# EAGLE design PAD03 (EAGLE 8.3.2)
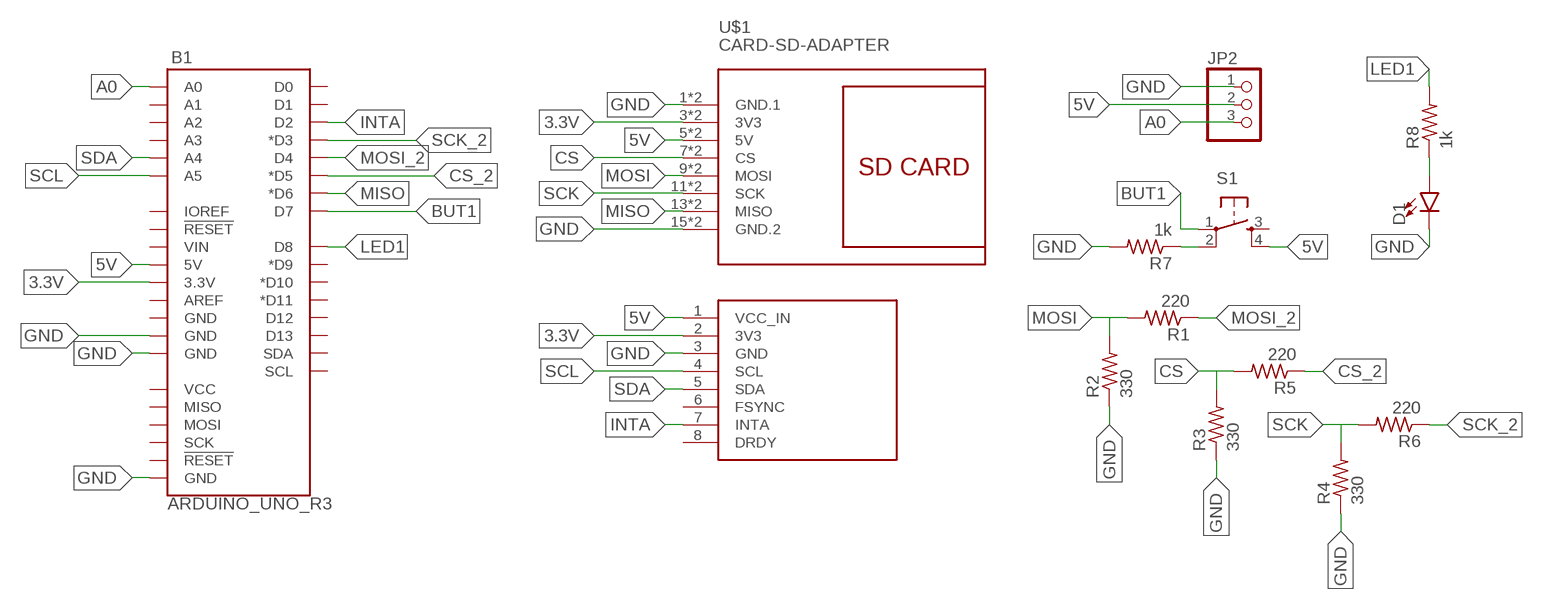
[diagram p0: schematic, sheet 1]

## Parts
B1  ARDUINO_UNO_R3  [ARDUINO_R3]
D1  LED5MM  [LED_5MM]
JP2  PINHD-1X3  [1X03]
R1  220  R-US_0204/7  [0204/7]
R2  330  R-US_0204/7  [0204/7]
R3  330  R-US_0204/7  [0204/7]
R4  330  R-US_0204/7  [0204/7]
R5  220  R-US_0204/7  [0204/7]
R6  220  R-US_0204/7  [0204/7]
R7  1k  R-US_0204/7  [0204/7]
R8  1k  R-US_0204/7  [0204/7]
S1  TAC_SWITCHPTH  [TACTILE-PTH]
U$1  CARD-SD-ADAPTER  [CARD-SD-ADAPTER]
U$2  GY-86  [GY-86]

## Nets
3.3V: B1.3.3V U$1.3(3V3) U$1.4(3V3) U$2.2(3V3)
5V: B1.5V JP2.2 S1.4 U$1.5(5V) U$1.6(5V) U$2.1(VCC_IN)
A0: B1.A0 JP2.3
BUT1: B1.D7 S1.1
CS: R3.2 R5.2 U$1.7(CS) U$1.8(CS)
CS_2: B1.D5(*D5) R5.1
GND: B1.GND@1(GND) B1.GND@2(GND) B1.GND@3(GND) D1.K(C) JP2.1 R2.1 R3.1 R4.1 R7.2 U$1.1(GND.1) U$1.2(GND.1) U$1.15(GND.2) U$1.16(GND.2) U$2.3(GND)
INTA: B1.D2 U$2.7(INTA)
LED1: B1.D8 R8.2
MISO: B1.D6(*D6) U$1.13(MISO) U$1.14(MISO)
MOSI: R1.2 R2.2 U$1.9(MOSI) U$1.10(MOSI)
MOSI_2: B1.D4 R1.1
N$1: R7.1 S1.2
N$2: D1.A R8.1
SCK: R4.2 R6.2 U$1.11(SCK) U$1.12(SCK)
SCK_2: B1.D3(*D3) R6.1
SCL: B1.A5 U$2.4(SCL)
SDA: B1.A4 U$2.5(SDA)
Unconnected: B1.A1 B1.A2 B1.A3 B1.AREF B1.D0 B1.D1 B1.D9(*D9) B1.D10(*D10) B1.D11(*D11) B1.D12 B1.D13 B1.GND@4(GND) B1.IOREF B1.MISO B1.MOSI B1.RESET@1(!RESET!) B1.RESET@2(!RESET!) B1.SCK B1.SCL B1.SDA B1.VCC B1.VIN S1.3 U$2.6(FSYNC) U$2.8(DRDY)

## Library data of the parts
B1 = SparkFun-Boards:ARDUINO_UNO_R3: Arduino R3 Footprint with SPI header Arduino Uno R3 Compatible Footprint. Matches PCB size of the original board. SparkFun Products: SAMD21 Dev Breakout <https://www.sparkfun.com/products/13672> RedBoard <https://www.sparkfun.com/products/12757> R3 Stackable Headers <https://www.sparkfun.com/products/11417>
D1 = SparkFun-LED:LED: LED (Generic) Standard schematic elements and footprints for 5mm, 3mm, 1206, and 0603 sized LEDs. Generic LEDs with no color specified.
JP2 = pinhead:PINHD-1X3: PIN HEADER
R1-R8 = resistor:R-US_: RESISTOR, American symbol
S1 = SparkFun-Retired:TAC_SWITCH: Momentary Switch Button commonly used for reset or general input. Spark Fun Electronics SKU : COM-00097 SMT- SWCH-08247
U$1 = diy-modules:CARD-SD-ADAPTER: Full Size SD Card Adapter Module with onboard 3.3V regulator Guide describing how to use SD card with Arduino is available here: https://www.arduino.cc/en/Reference/SDCardNotes Click here to find device on ebay.com <http://www.ebay.com/sch/sd+card+socket+module>
U$2 = GY_Boards:GY-86

## Net classes
0 default: width 1 mm, drill 1 mm, clearance 0.025 mm

## Board
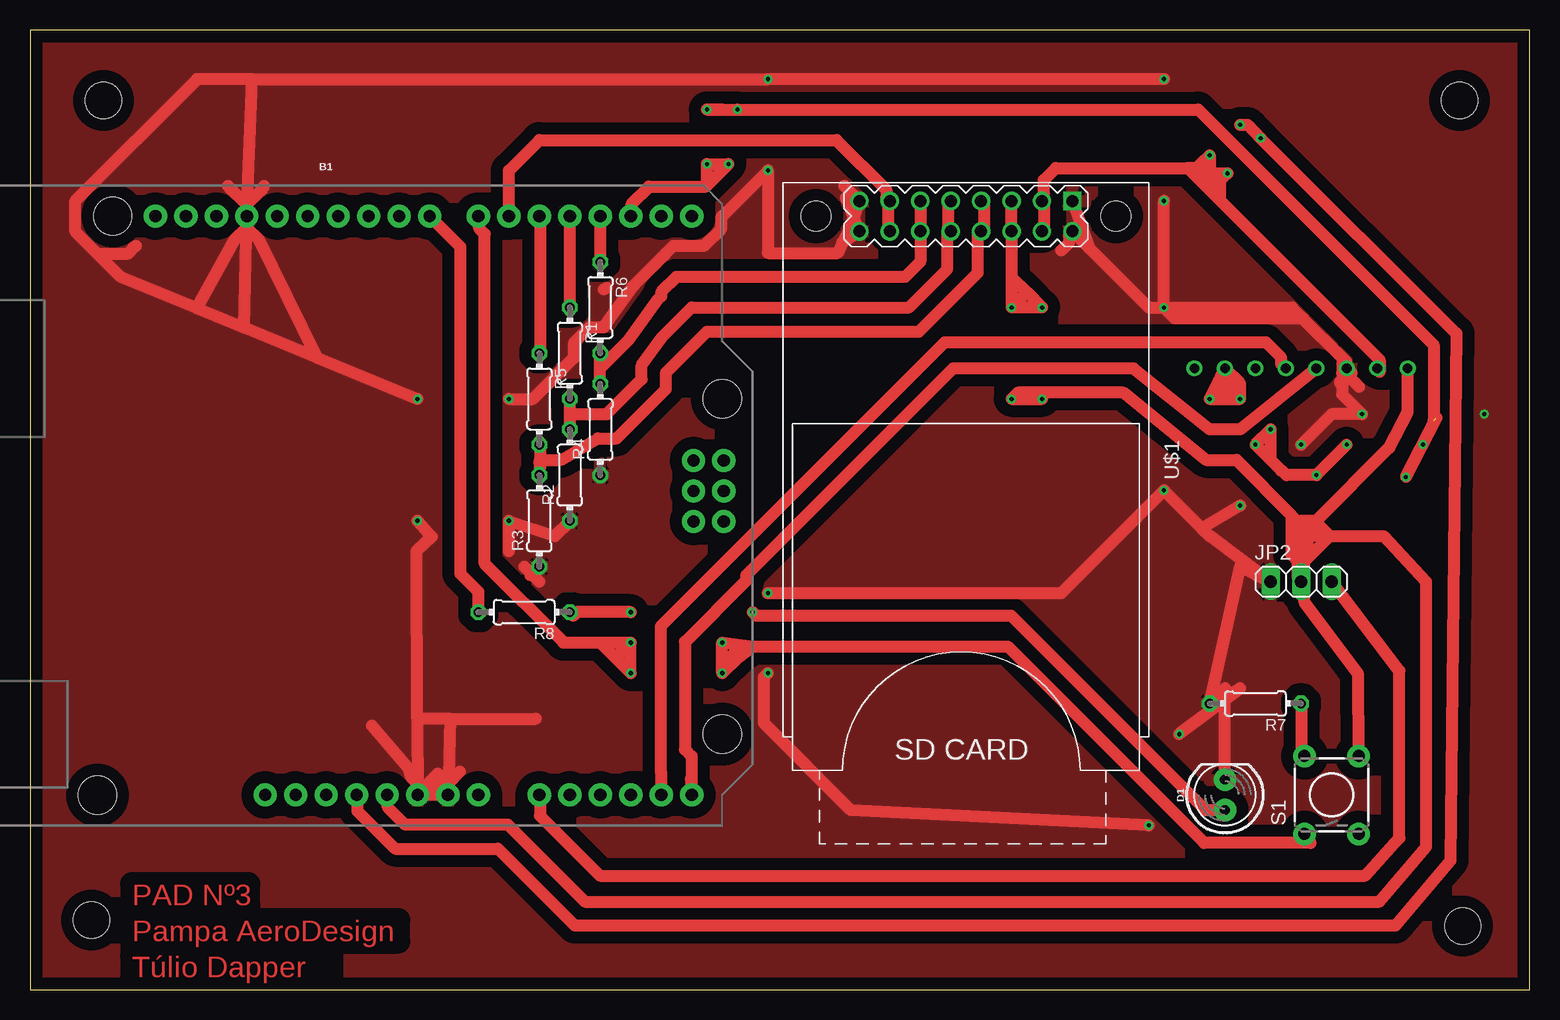
[diagram p1: board, top side]
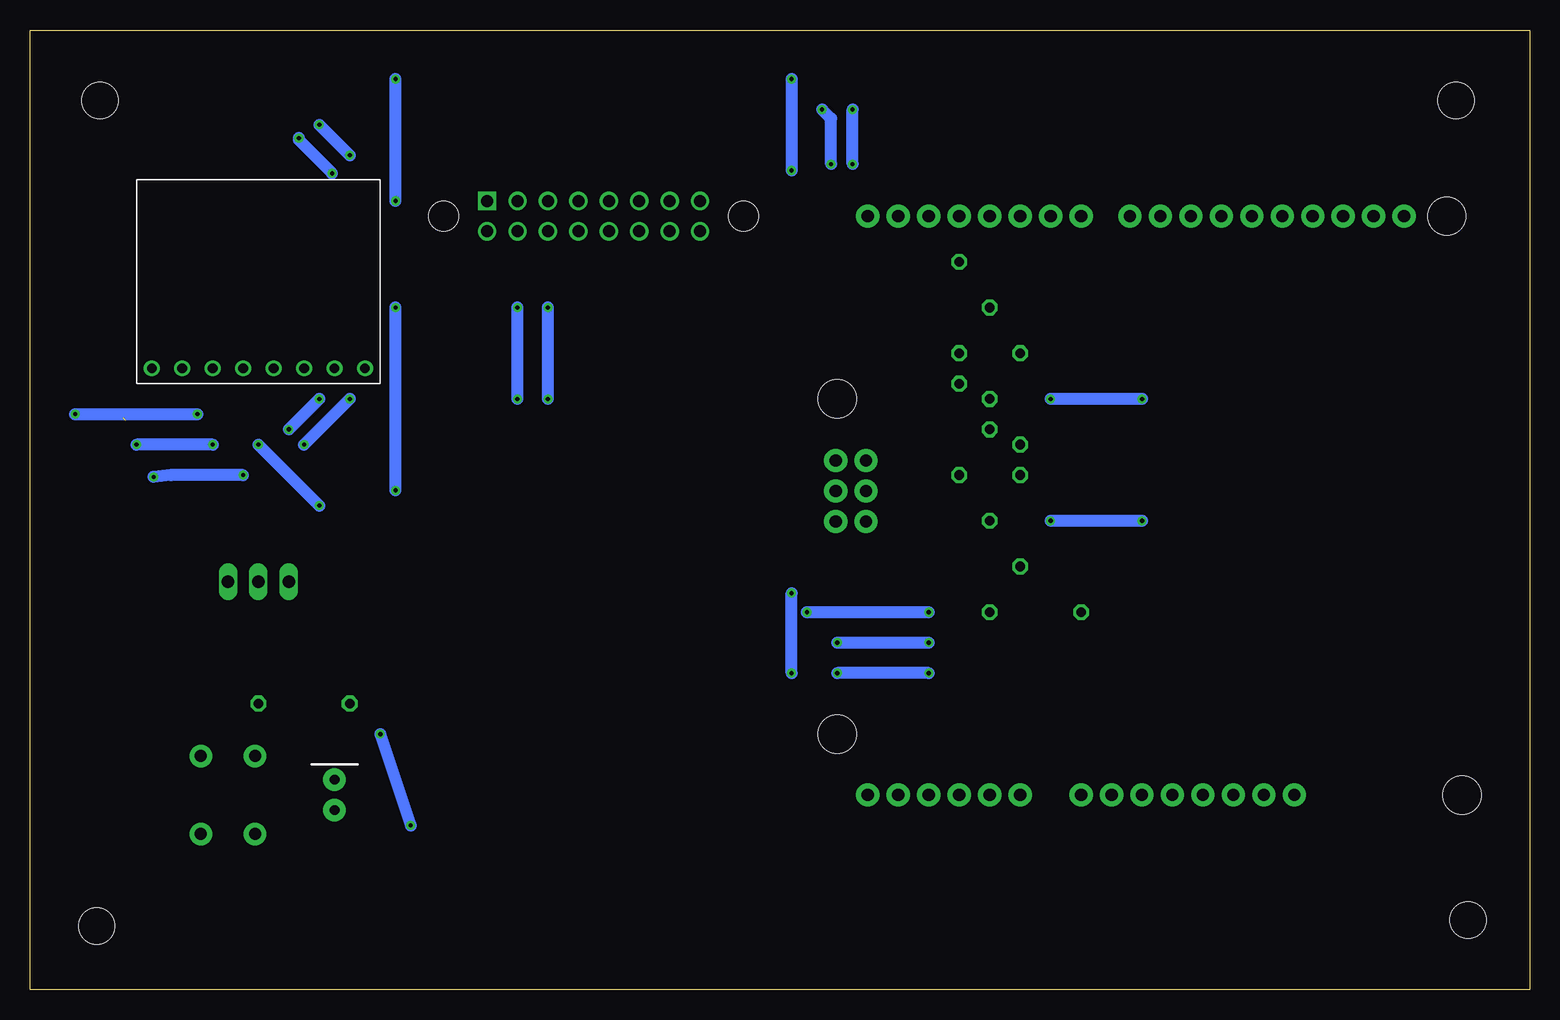
[diagram p2: board, bottom side, seen from below]

Size 125 x 80 mm. Coordinates in mm from the lower left corner, seen from the top.
Outline: 0,0 125,0 125,80 0,80 0,0
Copper layers (1*16): Top 0.035mm / dielectric 1.5mm / Bottom 0.035mm
Design rules "default *": minimum track width 1mm, minimum drill 0.35mm, track to track 1mm, track to pad 1mm, pad to pad 1mm, via to via 1mm, smd to smd 6mil, copper to edge 40mil, drill to drill 1mm, minimum pad ring 10mil, minimum via ring 8mil, stop-mask expansion 4mil, vias tented up to drill 0mil, thermal gap 10mil
Holes 3 mm at 119.43,5.29 5.13,5.79 6.13,74.12 119.16,74.12

### Footprints (pad centres in the part's own frame; a part is rotated, then mirrored left to right if it is on the bottom)
ARDUINO_R3 = drill 1.016 pad 1.93: 3.3V 2.54,-24.13; 5V 5.08,-24.13; A0 17.78,-24.13; A1 20.32,-24.13; A2 22.86,-24.13; A3 25.4,-24.13; A4 27.94,-24.13; A5 30.48,-24.13; AREF -9.144,24.13; D0 30.48,24.13; D1 27.94,24.13; D2 25.4,24.13; D3 22.86,24.13; D4 20.32,24.13; D5 17.78,24.13; D6 15.24,24.13; D7 12.7,24.13; D8 8.636,24.13; D9 6.096,24.13; D10 3.556,24.13; D11 1.016,24.13; D12 -1.524,24.13; D13 -4.064,24.13; GND@1 7.62,-24.13; GND@2 10.16,-24.13; GND@3 -6.604,24.13; GND@4 33.16,-1.32; IOREF -2.54,-24.13; MISO 30.62,3.76; MOSI 33.16,1.22; NC -5.08,-24.13; RESET@1 0,-24.13; RESET@2 30.62,-1.32; SCK 30.62,1.22; SCL -14.224,24.13; SDA -11.684,24.13; VCC 33.16,3.76; VIN 12.7,-24.13 | hole 3.175: -17.78,24.13; 33.02,8.89; 33.02,-19.05; -19.05,-24.13
LED_5MM = drill 0.813 pad 1.88: A -1.27,0; K 1.27,0
1X03 = drill 1.016 long: 1 -2.54,0; 2 0,0; 3 2.54,0
0204/7 = drill 0.813 octagon: 1 -3.81,0; 2 3.81,0
TACTILE-PTH = drill 1.016 pad 1.88: 1 -3.251,2.261; 2 3.251,2.261; 3 -3.251,-2.261; 4 3.251,-2.261
CARD-SD-ADAPTER = drill 1 square: 1 -21.59,8.89 | drill 1: 2 -19.05,8.89; 3 -21.59,6.35; 4 -19.05,6.35; 5 -21.59,3.81; 6 -19.05,3.81; 7 -21.59,1.27; 8 -19.05,1.27; 9 -21.59,-1.27; 10 -19.05,-1.27; 11 -21.59,-3.81; 12 -19.05,-3.81; 13 -21.59,-6.35; 14 -19.05,-6.35; 15 -21.59,-8.89; 16 -19.05,-8.89 | hole 2.5: -20.32,12.5; -20.32,-12.5
GY-86 = drill 0.8: 1 1.27,19.05; 2 1.27,16.51; 3 1.27,13.97; 4 1.27,11.43; 5 1.27,8.89; 6 1.27,6.35; 7 1.27,3.81; 8 1.27,1.27

### Placement (x,y rotation side)
B1  24.68,40.35 0 top
D1  99.61,16.22 90 top
JP2  105.96,34 0 top
R1  45,53.05 270 top
R2  45,42.89 90 top
R3  42.46,39.08 90 top
R4  47.54,46.7 90 top
R5  42.46,49.24 270 top
R6  47.54,56.86 270 top
R7  102.15,23.84 180 top
R8  41.19,31.46 180 top
S1  108.5,16.22 90 top
U$1  78.02,44.16 270 top
U$2  95.8,50.51 90 bottom

### Tracks (layer width: path | path; a pad name or v marks a point on that pad's centre or on a via)
3.3V  (via drill 0.35)
  Top 1: U$2.2 112.5,51.5 112.5,52.5 99.43,65.57 98.37,66.63 98.16,66.84 96.89,68.11 96.5,68.5 85.5,68.5 84.5,67.5 84.5,66.5 U$1.3 84.5,65.5 84.5,63.5 U$1.4
  Top 1.016: 97.7,68.92 v98.34,69.56 | 97.7,68.92 96.89,68.11 | B1.3.3V 27.29,16.15 27.29,14.88 30.44,11.73 39.02,11.73 45.44,5.31 113.81,5.31 118.41,10.74 118.91,54.7 v102.58,70.98 101.5,72.1 v100.88,72.1 | 99.19,67.44 98.37,66.63 | 99.19,67.44 99.19,65.81 99.43,65.57 | 97.7,68.29 97.7,68.92 | 97.7,68.29 97.7,67.3 98.16,66.84 | 99.19,67.44 98.55,67.44 98.02,67.97 | 98.02,67.97 97.7,68.29 | 99.19,67.44 99.79,68.05 v99.81,68.05 98.34,68.05 | v98.34,69.56 97.28,68.5 96.5,68.5 | v98.34,69.56 98.02,69.24 98.02,67.97 | 98.34,68.05 98.09,68.05 98.02,67.97 | v98.34,69.56 98.34,68.05
  Bottom 1.016: v98.34,69.56 v100.88,72.1 | v102.58,70.98 102.58,70.81 v99.81,68.05
5V  (via drill 0.35)
  Top 1.016: U$2.1 114.85,48.13 113.33,45.18 107.23,39.08 | B1.5V 29.83,16.15 29.83,15.2 31.28,13.75 39.85,13.75 46.27,7.33 112.48,7.33 116.39,11.91 116.39,34 112.85,37.81 108.34,37.81 | v81.83,56.86 U$1.6 U$1.5 | 83.1,49.76 83.85,49.76 v84.37,49.24 v81.83,49.24 82.35,49.76 91.16,49.76 98.03,44.16 100.57,44.16 105.13,39.52 | 81.83,59.4 83.1,58.13 | 83.1,58.13 v81.83,56.86 | v81.83,56.86 v84.37,56.86 83.1,58.13 | 105.13,39.52 105.76,38.88 | 105.76,38.88 105.96,38.68 105.96,37.81 | JP2.2 105.96,37.81 | 105.96,37.81 107.23,39.08 | JP2.2 106.23,34.27 106.23,35.7 106.51,35.99 | 106.51,35.99 108.34,37.81 | 108.34,37.81 105.96,37.81 | 106.51,35.99 106.51,37.26 105.96,37.81 | 107.23,39.08 107.23,38.92 108.34,37.81 | 107.23,39.08 105.96,39.08 105.76,38.88 | 105.13,39.52 105.13,36.27 105.69,35.7 105.69,34.27 JP2.2 | JP2.2 106.23,33.73 106.23,32.3 110.72,26.31 S1.4
  Bottom 1.016: v81.83,49.24 v81.83,56.86 | v84.37,49.24 v84.37,56.86
A0
  Top 1: 111.31,9.5 47.5,9.5 42.5,14.5 42.5,15.5 B1.A0
  Top 1.016: JP2.3 114.15,26.58 114.15,12.63 111.31,9.5
BUT1  (via drill 0.35)
  Top 1.016: S1.1 106.77,12.22 97.89,12.22 81.51,28.6 60.24,28.6 | B1.D7 37.45,64.41 37.45,63.46 37.9,63 37.9,35.49 44.47,28.92 47.54,28.92 | 47.54,28.92 v50.08,28.92 | v50.08,28.92 v50.08,26.38 48.81,27.65 | v57.7,26.38 58.97,27.65 60.24,28.6 | v57.7,26.38 58.56,27.88 60.24,28.6 | v57.7,26.38 v57.7,28.92 60.24,28.6 | 48.81,27.65 47.54,28.92 | 48.81,27.65 v50.08,28.92
  Bottom 1.016: v57.7,28.92 v50.08,28.92 | v50.08,26.38 v57.7,26.38
CS
  Top 1: R3.2 42.49,44.16 42.5,43.5 42.5,45.5 R5.2 | U$1.8 79.5,63.5 79.5,65.5 U$1.7
  Top 1.016: 42.49,44.16 44.26,44.16 47.32,45.95 48.9,45.95 53.01,50.06 53.01,51.39 53.08,51.49 56.43,54.84 74.09,54.84 79.01,59.77 79.01,62.93 U$1.8
CS_2
  Top 1: R5.1 42.5,53.5 42.5,64.5 B1.D5
GND  (via drill 0.35)
  Top 1.016: 32.28,22.57 32.23,36.54 33.5,37.74 v32.3,39.08 | 32.28,22.57 B1.GND@1 | 48.07,58.49 47.85,58.35 | 67.71,62.29 67.34,61.42 61.51,61.42 v61.51,68.29 57.63,64.41 57.63,63.46 56.18,62.01 53.65,62.01 50.32,58.68 47.81,55.22 46.64,55.22 45.37,53.95 45.37,52.68 41.93,49.24 v39.92,49.24 | 67.71,62.29 U$1.16 68.29,65.27 68.29,65.63 68.05,65.87 68,66 | 53.05,61.42 52.91,61.27 | D1.K 99.61,25.11 R7.2 | R7.2 100.88,35.27 JP2.1 98.34,37.81 97.7,38.45 | R2.1 43.73,37.81 v39.92,39.08 39.92,36.54 | 67.86,67.02 U$1.15 68.29,63.42 68.29,63.33 68.25,63.28 67.71,62.29 | 97.7,38.45 v94.53,41.62 85.96,33.05 v61.51,33.05 | v94.53,56.86 93.26,56.86 88.31,61.81 | 88.31,61.81 U$1.2 86.63,62.93 86.63,62.27 85.97,61.61 | v94.53,56.86 95.43,55.96 106.11,55.96 | U$2.3 109.39,51.4 | 109.25,50.51 109.25,50.74 109.39,50.88 | U$2.3 109.77,52.3 109.39,52.68 | U$2.3 110.15,51.4 110.15,50.88 110.78,50.25 | v94.53,56.86 v94.53,65.75 | 5.61,61.37 8.19,61.37 8.83,62.01 | v94.53,75.91 v61.51,75.91 18.5,75.91 | 18.5,75.91 13.93,75.91 3.79,65.77 3.79,63.19 5.61,61.37 | 109.39,52.68 109.39,50.88 | 109.39,50.88 109.39,49.62 v111.04,47.97 108.5,47.97 v105.96,45.43 | 106.11,55.96 109.39,52.68 | 106.11,55.96 105.21,56.86 v94.53,56.86 | v100.88,40.35 97.7,38.45 | 5.61,61.37 7.58,59.4 13.92,56.8 | 13.92,56.8 17.86,55.17 | 23.88,52.7 17.86,55.17 | 23.88,52.7 v32.3,49.24 | R3.1 41.72,34.53 41.72,34.74 | 41.72,34.74 42.46,34 | 41.19,35.27 41.72,34.74 | R7.2 100.88,25.11 v95.8,21.3 | v93.26,13.68 68.45,14.95 61.17,22.23 61.17,26.04 v61.51,26.38 | 35,22.57 42.15,22.57 | 35,22.57 32.28,22.57 | 17.86,55.17 B1.GND@3 | B1.GND@3 18.5,75.91 | 16.5,67 16.53,66.95 16.56,66.95 18.01,65.5 18.01,64.59 B1.GND@3
  Top 1.016: B1.GND@3 18.14,64.6 18.14,65.5 | 18.14,65.5 19.32,66.68 | 19.32,66.68 19.5,67 19.33,66.69 19.32,66.68 | 13.92,56.8 17.02,62.46 18.01,63.46 18.01,65.26 18.14,65.5 | B1.GND@3 18.14,64.34 18.14,63.46 19.01,62.59 23.88,52.7 | 35,22.57 B1.GND@2 | B1.GND@2 32.37,16.29 34,17 34,18 B1.GND@1 | B1.GND@2 34.91,16.32 34.91,17.24 35.83,18.17 | B1.GND@1 32.23,16.41 32.23,17.24 31.78,17.7 31.5,18.5 28.5,22 | U$1.1 87.75,63.4 87.75,63.33 87.78,63.29 88.31,61.81
  Bottom 1.016: 32.23,16.29 B1.GND@1 | v32.3,39.08 v39.92,39.08 | v94.53,41.62 v94.53,56.86 | v94.53,65.75 v94.53,75.91 | v61.51,75.91 v61.51,68.29 | v121.24,47.97 v111.04,47.97 | v32.3,49.24 v39.92,49.24 | v95.8,21.3 v93.26,13.68 | v61.51,26.38 v61.51,33.05 | v105.96,45.43 v100.88,40.35
  other vias: 32.3,16.22
  pour Top: -1.99,78.45 -1.99,-1.56 131.36,-1.56 130.09,2.25 130.09,78.45 128.32,82.22 -0.72,82.22
INTA  (via drill 0.35)  (1 unrouted)
  Top 1.016: B1.D2 50.15,64.55 50.15,65.5 51.6,66.95 56.36,66.95 56.43,67.02 | 56.43,67.02 v58.22,68.81 v56.43,68.81 56.43,67.02 | v114.69,42.73 117.23,47.67 | 117.01,47.44 117.01,53.74 97.38,73.37 v58.97,73.37 v56.43,73.37 57.7,73.37 | v109.77,45.43 v107.23,42.89 104.74,42.89 104.37,43.26 104.31,43.27 | 104.31,43.27 | 104.31,43.27 | v98.34,49.24 99.09,50.74 99.23,50.88 99.23,51.02 U$2.7 100.88,50.51 | 104.31,43.27 103.42,44.16 | 103.42,44.16 v102.15,45.43 v103.42,46.7 103.42,44.16 | v100.88,49.24 99.61,50.51 | v100.88,49.24 100.88,50.51 | v98.34,49.24 v100.88,49.24 | v98.34,49.24 99.61,49.24 100.88,50.51 | 100.88,50.51 99.61,50.51 | 99.61,50.51 v98.34,49.24
  Bottom 1.016: v58.22,68.81 58.22,72.62 v58.97,73.37 | v107.23,42.89 113.27,42.89 v114.69,42.73 | v56.43,68.81 v56.43,73.37 | v109.77,45.43 v116.12,45.43 | v102.15,45.43 v98.34,49.24 | v103.42,46.7 v100.88,49.24
LED1
  Top 1.016: R8.2 37.38,33.16 35.89,34.65 35.89,61.91 B1.D8
MISO
  Top 1: U$1.14 71.5,63.5 71.5,65.5 U$1.13
  Top 1.016: B1.D6 39.92,68.29 42.46,70.83 67.25,70.83 71.39,66.69 71.39,66.03 U$1.13
MOSI
  Top 1: U$1.10 76.5,63.5 76.5,65.5 U$1.9
  Top 1.016: R2.2 45,47.97 | 45,47.97 R1.2 | 45,47.97 48.07,47.97 50.99,50.89 50.99,52.05 52.68,54.38 55.16,56.86 73.25,56.86 76.47,60.08 76.47,62.93 U$1.10
MOSI_2
  Top 1.016: R1.1 B1.D4
N$1
  Top 1.016: R7.1 105.96,19.19 S1.2
N$2  (via drill 0.35)
  Top 1.016: D1.A 98.02,14.95 81.8,31.16 60.54,31.16 v60.24,31.46 | R8.1 45.3,31.16 45.59,31.46 v50.08,31.46
  Bottom 1.016: v60.24,31.46 v50.08,31.46
SCK
  Top 1.016: U$1.11 U$1.12 74.21,60.67 72.94,59.4 53.89,59.4 52.62,58.13 52.62,57.81 52.33,57.52 49.84,54.09 47.54,51.78 | 47.54,51.78 R6.2 | R4.2 47.54,51.78
SCK_2
  Top 1: R6.1 47.5,60.5 47.5,64.5 B1.D3
SCL
  Top 1.016: 55.09,17.55 55.09,16.29 B1.A5 55.16,19.44 54.59,20.01 54.59,28.98 59.7,34.09 59.7,34.54 76.94,51.78 91.99,51.78 98.34,46.7 100.88,46.7 U$2.4
SDA
  Top 1.016: U$2.5 104.31,52.16 104.31,52.68 103.05,53.94 76.25,53.94 52.57,30.27 52.57,18.14 52.62,18.09 B1.A4

### Text on the board
Top: PAD Nº3 | Pampa AeroDesign | Túlio Dapper